# EAGLE design LP2985_1v8 (EAGLE 7.4.0)
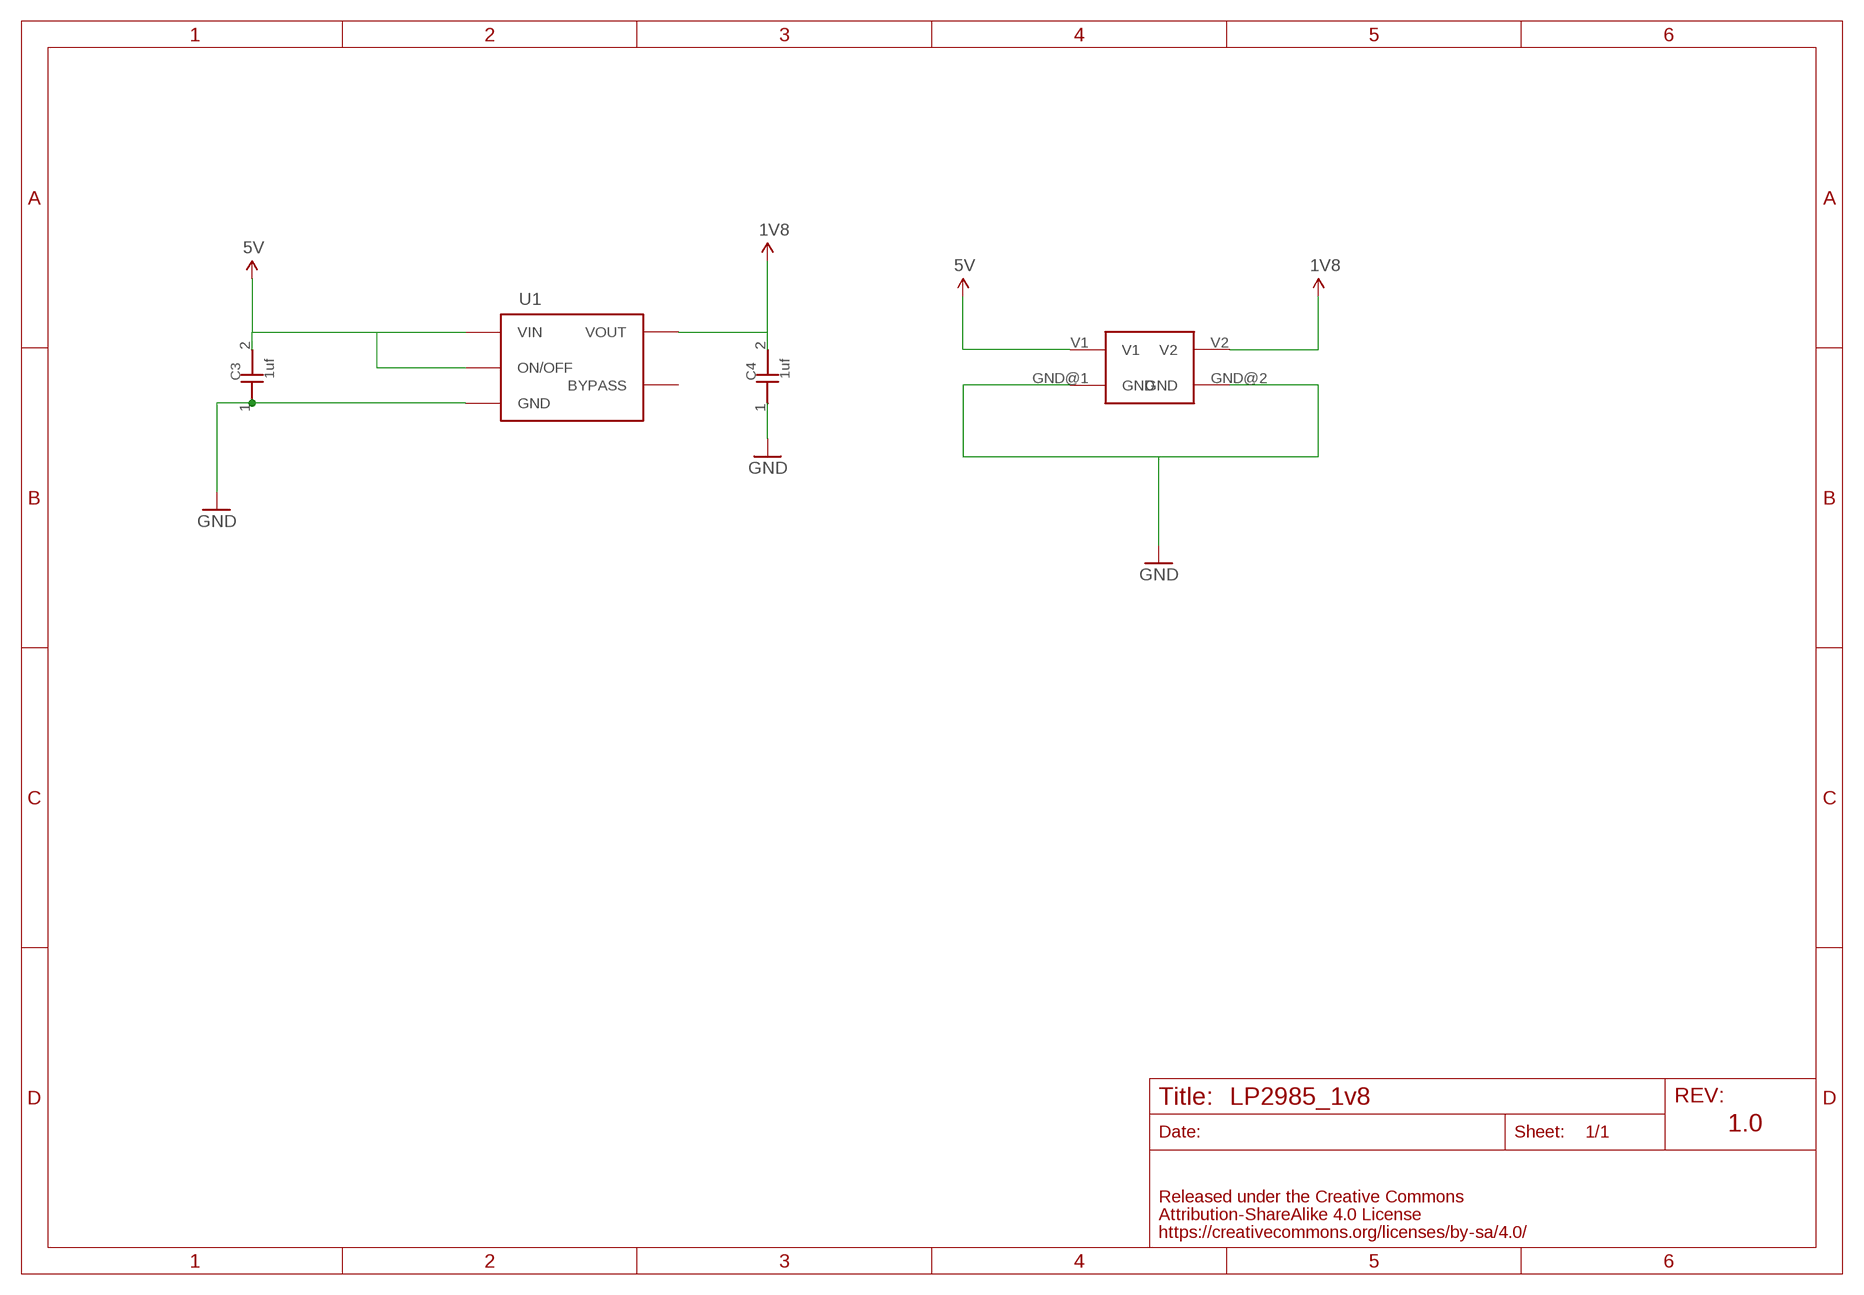
[diagram p0: schematic, sheet 1]

## Parts
C3  1uf  CAPACITOR0603  [0603]
C4  1uf  CAPACITOR0603  [0603]
U1  LP2985-33DBVR  [SOT_23_5]
U$2  4PIN-REGULATOR  [4PIN-REGULATOR]

## Nets
5V: C3.2 U1.1(VIN) U1.3(ON/OFF) U$2.V1
GND: C3.1 C4.1 U1.2(GND) U$2.GND@1(GND) U$2.GND@2(GND)
VCC: C4.2 U1.5(VOUT) U$2.V2 ; supply symbol labelled 1V8
Unconnected: U1.4(BYPASS)

## Notes on the sheet
- 1.0

## Library data of the parts
C3 C4 = GClue-Capacitor:CAPACITOR
U1 = FaBo-Supply:LP2985: LP2985 IC REG LDO 3.3V 0.15 A
U$2 = FaBo-Breakout:4PIN-REGULATOR

## Board
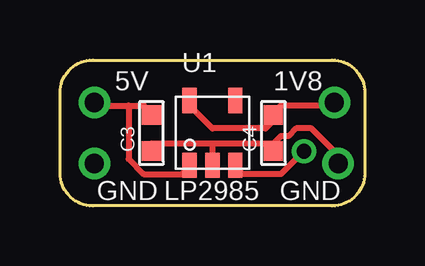
[diagram p1: board, top side]
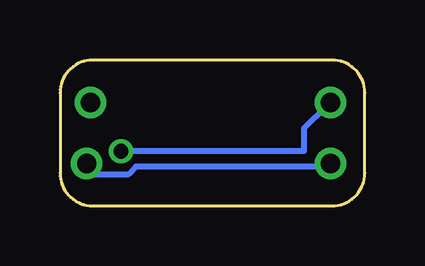
[diagram p2: board, bottom side, seen from below]

Size 12.7 x 6.08 mm. Coordinates in mm from the lower left corner, seen from the top.
Copper layers (1*16): Top 0.035mm / dielectric 1.5mm / Bottom 0.035mm
Design rules "default": minimum track width 10mil, minimum drill 24mil, track to track 8mil, track to pad 8mil, pad to pad 8mil, via to via 8mil, smd to smd 8mil, copper to edge 40mil, drill to drill 8mil, minimum pad ring 10mil, minimum via ring 8mil, stop-mask expansion 4mil, vias tented up to drill 0mil, thermal gap 10mil

### Footprints (pad centres in the part's own frame; a part is rotated, then mirrored left to right if it is on the bottom)
0603 = smd 0.8 x 0.8: 1 -0.75,0; 2 0.75,0
SOT_23_5 = smd 0.6 x 1.05: 1 -0.95,-1.35; 2 0,-1.35; 3 0.95,-1.35; 4 0.95,1.35; 5 -0.95,1.35
4PIN-REGULATOR = drill 0.8: GND@1 -4.92,-1.27; GND@2 5.24,-1.27; V1 -4.92,1.27; V2 5.08,1.27

### Placement (x,y rotation side)
C3  3.81,3.04 90 top
C4  8.89,3.04 90 top
U1  6.35,3.04 0 top
U$2  6.35,3.04 0 top

### Tracks (layer width: path | path; a pad name or v marks a point on that pad's centre or on a via)
5V  (via drill 0.61)
  Top 0.254: 2.86,4.18 1.59,4.18 U$2.V1 | 2.86,4.18 3.49,4.18 3.81,3.87 C3.2 | 2.86,4.18 2.86,1.96 3.49,1.32 5.08,1.32 5.4,1.64 U1.1 | v10.16,2.28 9.21,1.32 7.62,1.32 7.3,1.64 U1.3
  Bottom 0.254: v10.16,2.28 2.54,2.28 2.54,3.23 1.59,4.18 U$2.V1
GND
  Top 0.254: 8.89,2.6 6.35,2.6 | 6.35,2.6 3.81,2.6 C3.1 | 6.35,2.6 U1.2 | 8.89,2.6 9.21,2.91 9.53,2.91 9.84,3.23 10.48,3.23 11.43,2.28 11.43,1.96 U$2.GND@2 | 8.89,2.6 C4.1
  Bottom 0.254: U$2.GND@1 1.59,1.64 9.53,1.64 9.84,1.32 11.43,1.32 11.43,1.64 U$2.GND@2
VCC
  Top 0.254: U$2.V2 11.43,4.18 9.21,4.18 8.89,3.87 C4.2 8.89,3.55 8.57,3.23 6.35,3.23 5.4,4.18 U1.5

### Text on the board
tPlace: 5V | 1V8 | GND | LP2985 | GND